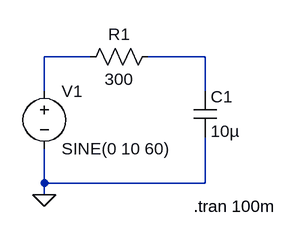
[diagram p0: schematic TRAN Analysis.asc]
TRAN Analysis.asc, the LTspice schematic file:
Version 4
SHEET 1 880 680
WIRE 80 96 16 96
WIRE 240 96 160 96
WIRE 16 144 16 96
WIRE 240 144 240 96
WIRE 16 272 16 224
WIRE 240 272 240 208
WIRE 240 272 16 272
WIRE 16 288 16 272
FLAG 16 288 0
SYMBOL voltage 16 128 R0
WINDOW 123 0 0 Left 0
WINDOW 39 0 0 Left 0
SYMATTR InstName V1
SYMATTR Value SINE(0 10 60)
SYMBOL res 176 80 R90
WINDOW 0 0 56 VBottom 2
WINDOW 3 32 56 VTop 2
SYMATTR InstName R1
SYMATTR Value 300
SYMBOL cap 224 144 R0
SYMATTR InstName C1
SYMATTR Value 10µ
TEXT 224 304 Left 2 !.tran 100m

The netlist it stands for:
* TRAN Analysis.asc
V1 N001 0 SINE(0 10 60)
R1 N002 N001 300
C1 N002 0 10µ
.tran 100m
.backanno
.end